# EAGLE schematic riread_schema (EAGLE 7.3.0)
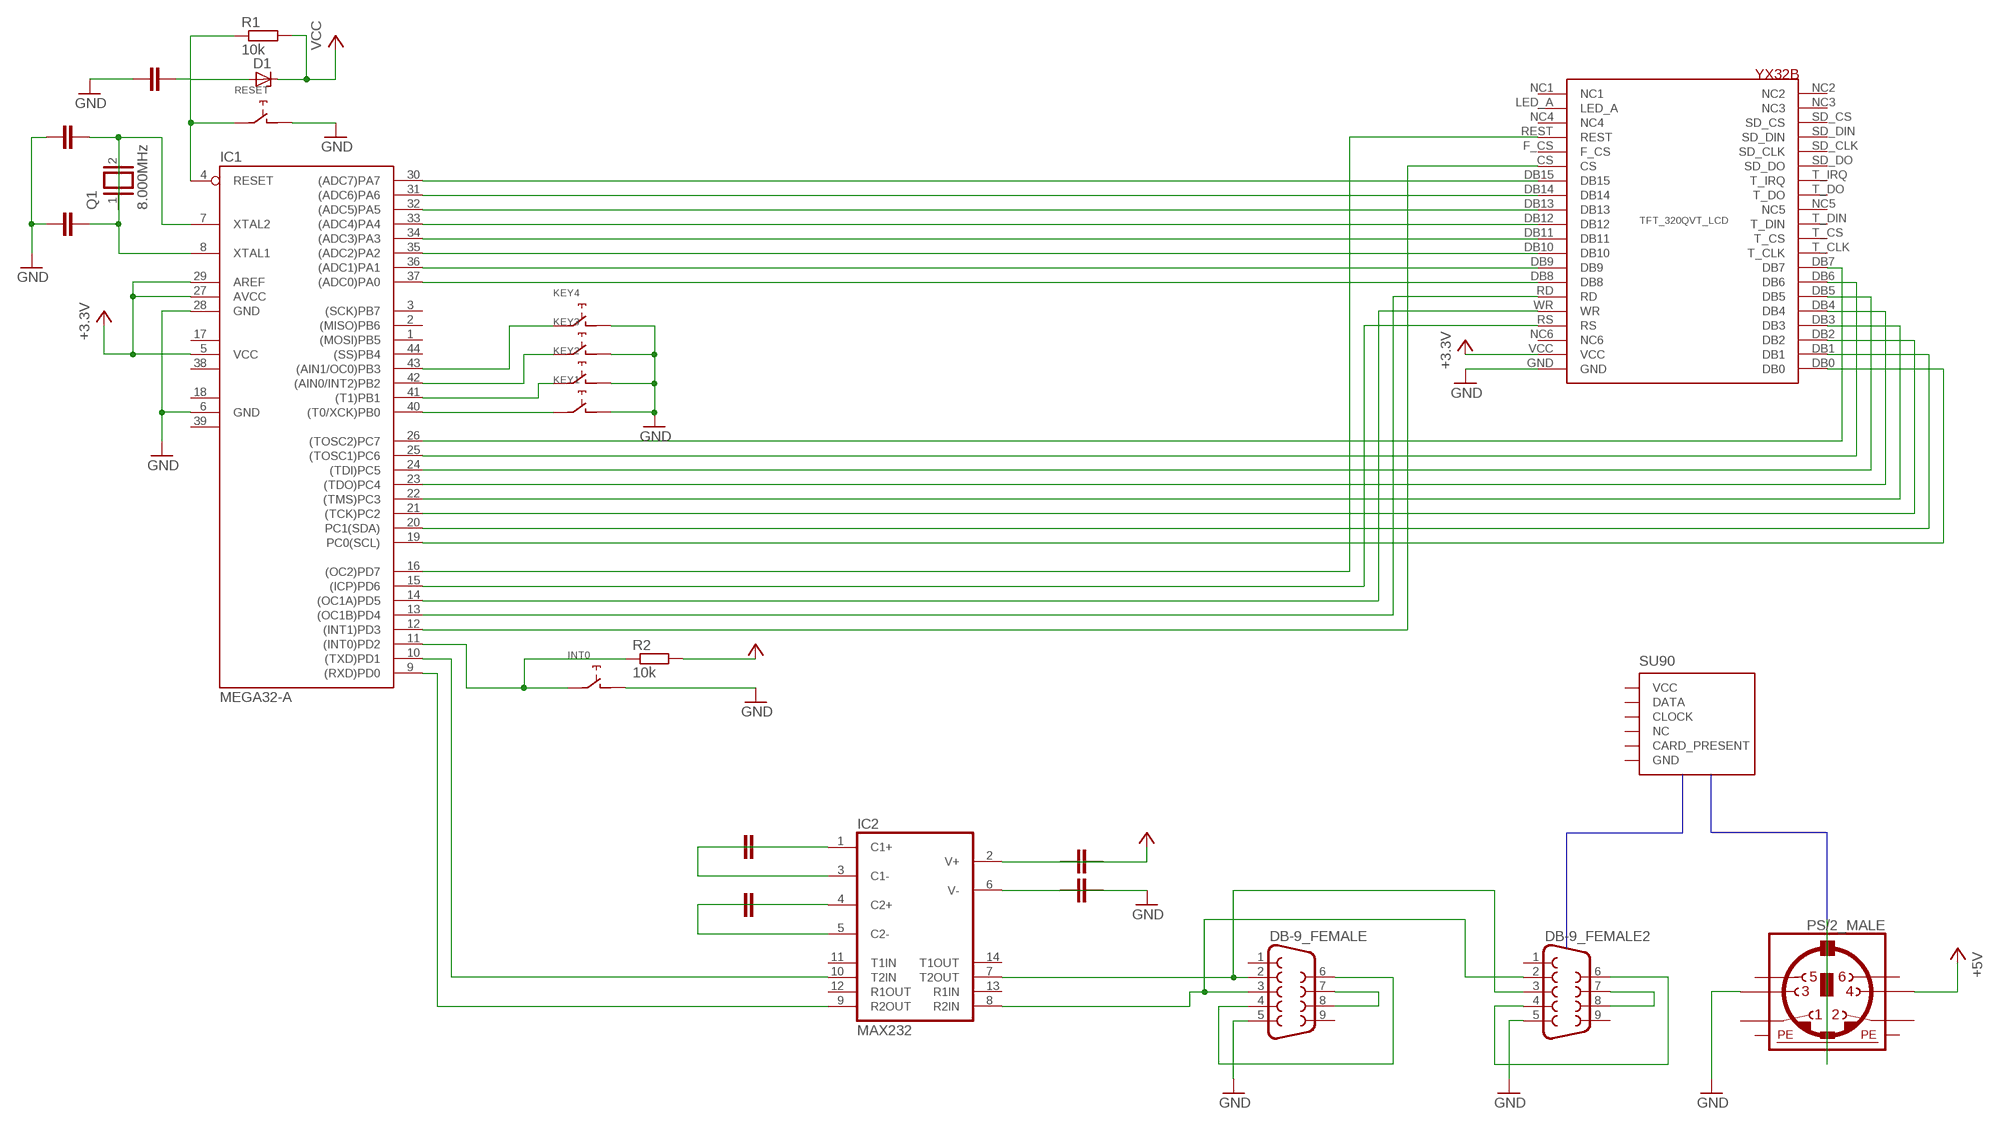
[diagram p0: schematic, sheet 1]

## Parts
D1  1N821  [DO35Z10]
DB-9_FEMALE  F09VP  [F09VP]
DB-9_FEMALE2  F09VP  [F09VP]
IC1  MEGA32-A  [TQFP44]
IC2  MAX232  [DIL16]
INT0  EC12E_SW  [ALPS_EC12E_SW]
KEY1  EC12E_SW  [ALPS_EC12E_SW]
KEY2  EC12E_SW  [ALPS_EC12E_SW]
KEY3  EC12E_SW  [ALPS_EC12E_SW]
KEY4  EC12E_SW  [ALPS_EC12E_SW]
PS/2_MALE  MINI_DIN_6  [M_DIN6]
Q1  8.000MHz  XTAL  [Q]
R1  10k  R-EU_0204/2V  [0204V]
R2  10k  R-EU_0204/2V  [0204V]
RESET  EC12E_SW  [ALPS_EC12E_SW]
X1  FPS009-30003  [FPS009-3003]
YX32B  3.2" TFT LCD  TFT_320QVT  [TFT_320QVT]

## Nets
+5V: IC1.5(VCC) IC1.27(AVCC) IC1.29(AREF) IC2.2(V+) PS/2_MALE.5 R2.2 YX32B.VCC ; supply symbol labelled +3.3V
GND: DB-9_FEMALE2.5 DB-9_FEMALE.5 IC1.6(GND) IC1.28(GND) IC2.6(V-) KEY1.D KEY2.D KEY3.D KEY4.D PS/2_MALE.3 RESET.D YX32B.GND
N$1: IC1.13((OC1B)PD4) YX32B.RD
N$2: IC1.36((ADC1)PA1) YX32B.DB9
N$3: IC1.35((ADC2)PA2) YX32B.DB10
N$4: IC1.34((ADC3)PA3) YX32B.DB11
N$5: IC1.33((ADC4)PA4) YX32B.DB12
N$6: IC1.32((ADC5)PA5) YX32B.DB13
N$7: IC1.31((ADC6)PA6) YX32B.DB14
N$8: IC1.30((ADC7)PA7) YX32B.DB15
N$9: IC1.40((T0/XCK)PB0) KEY1.E
N$10: IC1.26((TOSC2)PC7) YX32B.DB7
N$11: IC1.24((TDI)PC5) YX32B.DB5
N$12: IC1.23((TDO)PC4) YX32B.DB4
N$13: IC1.22((TMS)PC3) YX32B.DB3
N$14: IC1.21((TCK)PC2) YX32B.DB2
N$15: IC1.20(PC1(SDA)) YX32B.DB1
N$16: IC1.19(PC0(SCL)) YX32B.DB0
N$17: D1.A IC1.4(RESET) R1.1 RESET.E
N$18: IC1.11((INT0)PD2) INT0.E R2.1
N$19: IC1.14((OC1A)PD5) YX32B.WR
N$20: IC1.41((T1)PB1) KEY2.E
N$21: IC1.25((TOSC1)PC6) YX32B.DB6
N$22: IC1.42((AIN0/INT2)PB2) KEY3.E
N$23: IC1.43((AIN1/OC0)PB3) KEY4.E
N$24: IC1.16((OC2)PD7) YX32B.REST
N$25: IC1.15((ICP)PD6) YX32B.RS
N$26: IC1.37((ADC0)PA0) YX32B.DB8
N$27: IC1.10((TXD)PD1) IC2.10(T2IN)
N$28: IC1.12((INT1)PD3) YX32B.CS
N$29: IC1.9((RXD)PD0) IC2.9(R2OUT)
N$30: DB-9_FEMALE2.2 DB-9_FEMALE.3 IC2.8(R2IN)
N$31: IC2.1(C1+) IC2.3(C1-)
N$32: DB-9_FEMALE2.7 DB-9_FEMALE2.8
N$33: IC2.4(C2+) IC2.5(C2-)
N$34: DB-9_FEMALE.4 DB-9_FEMALE.6
N$35: IC1.7(XTAL2) IC1.8(XTAL1) Q1.1
N$36: DB-9_FEMALE2.3 DB-9_FEMALE.2 IC2.7(T2OUT)
N$37: DB-9_FEMALE.7 DB-9_FEMALE.8
N$39: DB-9_FEMALE2.4 DB-9_FEMALE2.6
N$40: PS/2_MALE.SH2(PE2)
VCC: D1.C R1.2
Unconnected: DB-9_FEMALE2.1 DB-9_FEMALE2.9 DB-9_FEMALE.1 DB-9_FEMALE.9 IC1.1((MOSI)PB5) IC1.2((MISO)PB6) IC1.3((SCK)PB7) IC1.44((SS)PB4) IC2.11(T1IN) IC2.12(R1OUT) IC2.13(R1IN) IC2.14(T1OUT) INT0.A INT0.B INT0.C INT0.D INT0.GND1(G) INT0.GND2(G) KEY1.A KEY1.B KEY1.C KEY1.GND1(G) KEY1.GND2(G) KEY2.A KEY2.B KEY2.C KEY2.GND1(G) KEY2.GND2(G) KEY3.A KEY3.B KEY3.C KEY3.GND1(G) KEY3.GND2(G) KEY4.A KEY4.B KEY4.C KEY4.GND1(G) KEY4.GND2(G) PS/2_MALE.1 PS/2_MALE.2 PS/2_MALE.6 PS/2_MALE.8 Q1.2 RESET.A RESET.B RESET.C RESET.GND1(G) RESET.GND2(G) X1.1(VCC) X1.2(DATA) X1.3(CLOCK) X1.4(NC) X1.5(CARD_PRESENT) X1.6(GND) YX32B.F_CS YX32B.LED_A YX32B.NC1 YX32B.NC2 YX32B.NC3 YX32B.NC4 YX32B.NC5 YX32B.NC6 YX32B.SD_CLK YX32B.SD_CS YX32B.SD_DIN YX32B.SD_DO YX32B.T_CLK YX32B.T_CS YX32B.T_DIN YX32B.T_DO YX32B.T_IRQ

## Buses
B$1
B$2

## Power pins joined to a net without a drawn wire
GND: IC2.15(GND)
GND1: IC1.18(GND1)
GND2: IC1.39(GND2)
PE1: PS/2_MALE.SH1(PE1)
PE3: PS/2_MALE.SH3(PE3)
VCC: IC2.16(VCC)
VCC1: IC1.17(VCC1)
VCC2: IC1.38(VCC2)

## Library data of the parts
D1 = diode:1N821: Reference DIODE temperature compensated, 6,2 V
DB-9_FEMALE DB-9_FEMALE2 = con-subd:F09: SUB-D; OC_FARNELL: unknown; OC_NEWARK: unknown
IC1 = atmel:MEGA32: MICROCONTROLLER 32 Kbytes FLASH 2 Kbytes SRAM 1 Kbytes EEPROM USART 8-channel 10 bit ADC Source: www.atmel.com .. doc2503.pdf; MPN: ATMEGA32-16AU; OC_FARNELL: 9171274; OC_NEWARK: 69K6677
IC2 = maxim:MAX232: RS232 TRANSCEIVER; MF: MAXIM; MPN: MAX232ACPE+; OC_FARNELL: 9723773; OC_NEWARK: 68K4544
INT0 KEY1-KEY4 RESET = switch-alps:EC12E_SW: ALPS rotary Encoder EC12E series with switch; MPN: EC12E2424407; OC_FARNELL: 1520813; OC_NEWARK: 74M1068
PS/2_MALE = mini_din:MINI_DIN_6
Q1 = special:XTAL: CRYSTAL
R1 R2 = resistor:R-EU_: RESISTOR, European symbol
X1 = con-yamaichi3:FPS009-30*: SD Card and MMC Reader (Manual Insertion) Source: http://www.yamaichi.de/pdf/c_fps009_3000.pdf; MPN: FPS009-3003-BL; OC_FARNELL: 1143953; OC_NEWARK: 91K9876
YX32B = TFT_320QVT:TFT_320QVT